# EAGLE design bmscableNucleo (EAGLE 4.13)
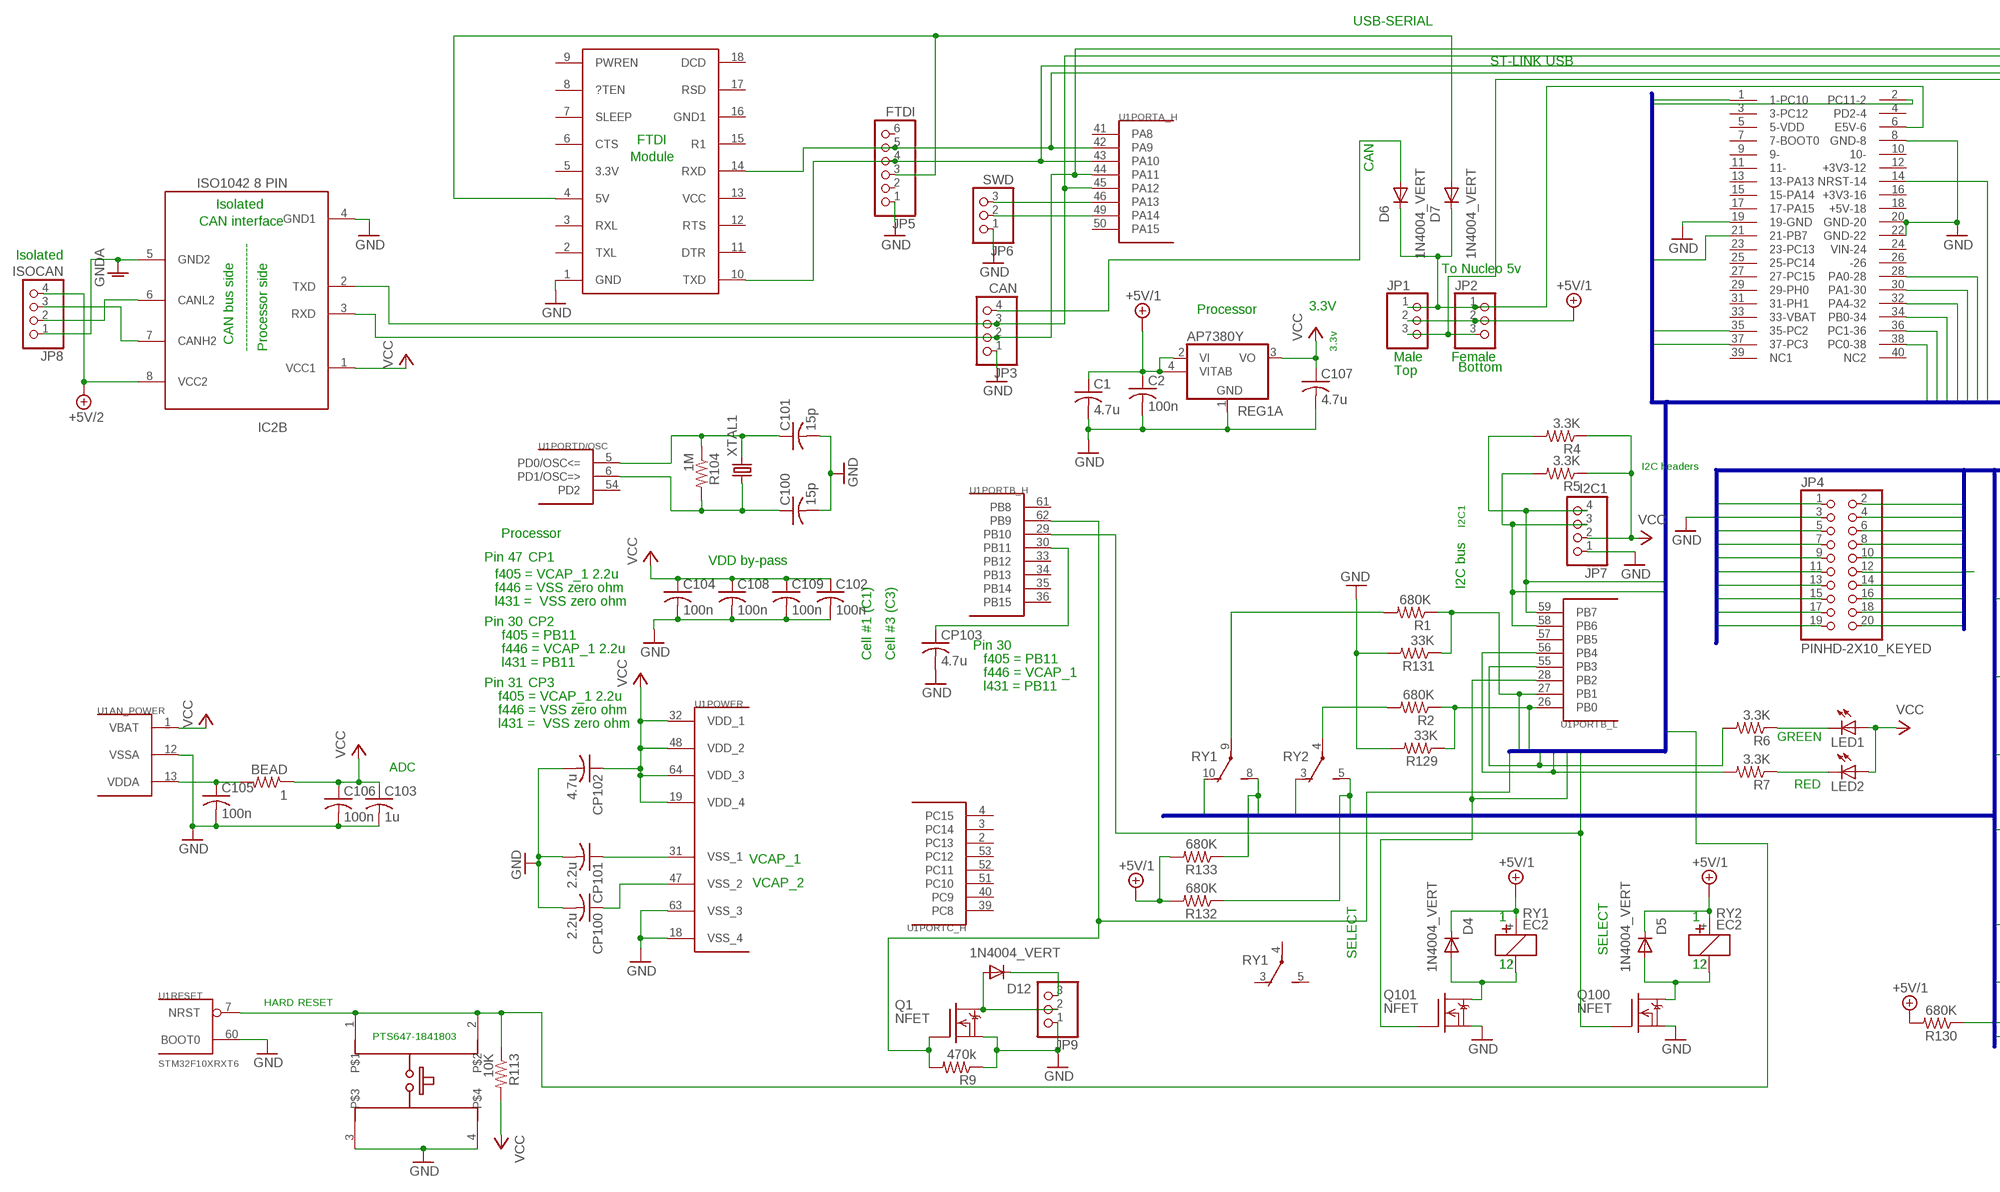
[diagram p0: schematic, sheet 1, part 1 of 2]
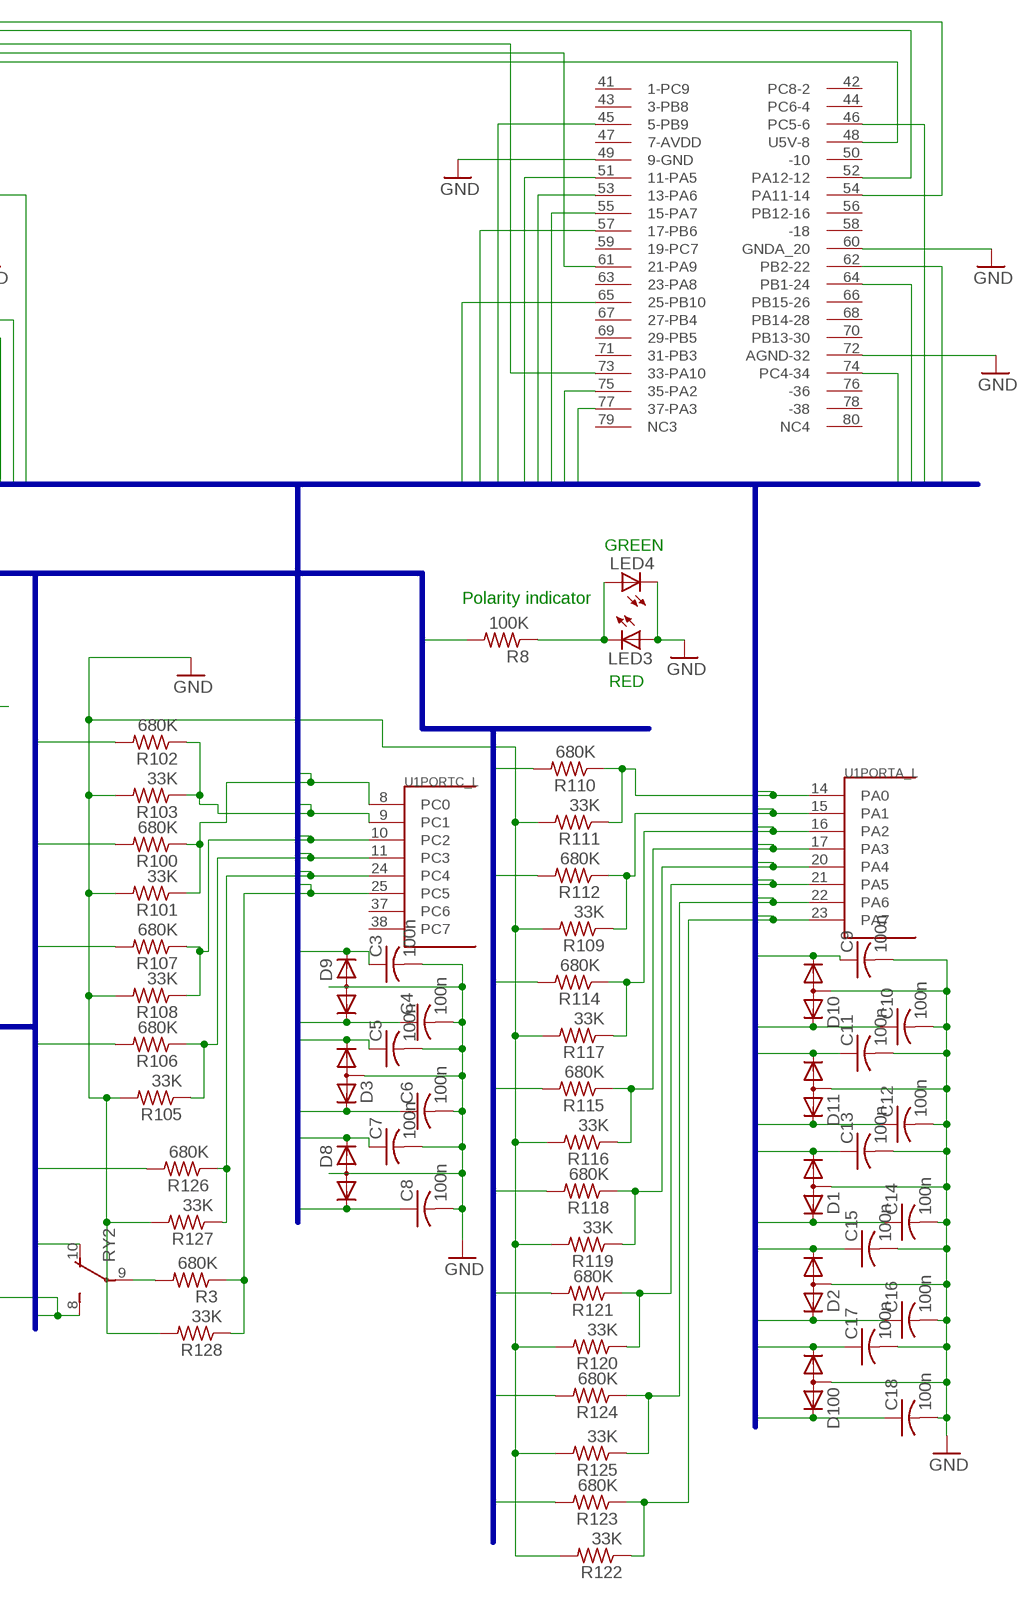
[diagram p1: schematic, sheet 1, part 2 of 2]

## Parts
BEAD  1  R-US_R0603  [R0603]
C1  4.7u  C-USC0603  [C0603]
C2  100n  C-USC0603  [C0603]
C3  100n  C-USC0603  [C0603]
C4  100n  C-USC0603  [C0603]
C5  100n  C-USC0603  [C0603]
C6  100n  C-USC0603  [C0603]
C7  100n  C-USC0603  [C0603]
C8  100n  C-USC0603  [C0603]
C9  100n  C-USC0603  [C0603]
C10  100n  C-USC0603  [C0603]
C11  100n  C-USC0603  [C0603]
C12  100n  C-USC0603  [C0603]
C13  100n  C-USC0603  [C0603]
C14  100n  C-USC0603  [C0603]
C15  100n  C-USC0603  [C0603]
C16  100n  C-USC0603  [C0603]
C17  100n  C-USC0603  [C0603]
C18  100n  C-USC0603  [C0603]
C100  15p  C-USC0603  [C0603]
C101  15p  C-USC0603  [C0603]
C102  100n  C-USC0603  [C0603]
C103  1u  C-USC0603  [C0603]
C104  100n  C-USC0603  [C0603]
C105  100n  C-USC0603  [C0603]
C106  100n  C-USC0603  [C0603]
C107  4.7u  C-USC0805  [C0805]
C108  100n  C-USC0603  [C0603]
C109  100n  C-USC0603  [C0603]
CP100  2.2u  C-USC0603  [C0603]
CP101  2.2u  C-USC0603  [C0603]
CP102  4.7u  C-USC0603  [C0603]
CP103  4.7u  C-USC0603  [C0603]
D1  DIODE-2CA|ACSOT23  [SOT23]
D2  DIODE-2CA|ACSOT23  [SOT23]
D3  DIODE-2CA|ACSOT23  [SOT23]
D4  1N4004_VERT  [DO41-10_VERT]
D5  1N4004_VERT  [DO41-10_VERT]
D6  1N4004_VERT  [DO41-10_VERT]
D7  1N4004_VERT  [DO41-10_VERT]
D8  DIODE-2CA|ACSOT23  [SOT23]
D9  DIODE-2CA|ACSOT23  [SOT23]
D10  DIODE-2CA|ACSOT23  [SOT23]
D11  DIODE-2CA|ACSOT23  [SOT23]
D12  1N4004_VERT  [DO41-10_VERT]
D100  DIODE-2CA|ACSOT23  [SOT23]
IC2B  ISO1042 8 PIN  ISO1042  [SO-08]
JP1  PINHD-1X3  [1X03]
JP2  PINHD-1X3  [1X03]
JP3  CAN  PINHD-1X4  [1X04]
JP4  PINHD-2X10_KEYED  [2X10_KEYED]
JP5  FTDI  PINHD-1X6  [1X06]
JP6  SWD  PINHD-1X3  [1X03]
JP7  I2C1  PINHD-1X4  [1X04]
JP8  ISOCAN  PINHD-1X4  [1X04]
JP9  PINHD-1X3  [1X03]
LED1  LEDCHIP-LED0603  [CHIP-LED0603]
LED2  LEDCHIP-LED0603  [CHIP-LED0603]
LED3  LEDCHIP-LED0603  [CHIP-LED0603]
LED4  LEDCHIP-LED0603  [CHIP-LED0603]
NUCLEO-HEADER  NUCLEO446R-20  [NUCLEO-64-20]
Q1  NFET  DMN3404L  [SOT-23]
Q100  NFET  DMN3404L  [SOT-23]
Q101  NFET  DMN3404L  [SOT-23]
R1  680K  R-US_R0603  [R0603]
R2  680K  R-US_R0603  [R0603]
R3  680K  R-US_R0603  [R0603]
R4  3.3K  R-US_R0603  [R0603]
R5  3.3K  R-US_R0603  [R0603]
R6  3.3K  R-US_R0603  [R0603]
R7  3.3K  R-US_R0603  [R0603]
R8  100K  R-US_R0603  [R0603]
R9  470k  R-US_R0603  [R0603]
R100  680K  R-US_R0603  [R0603]
R101  33K  R-US_R0603  [R0603]
R102  680K  R-US_R0603  [R0603]
R103  33K  R-US_R0603  [R0603]
R104  1M  R-US_R0603  [R0603]
R105  33K  R-US_R0603  [R0603]
R106  680K  R-US_R0603  [R0603]
R107  680K  R-US_R0603  [R0603]
R108  33K  R-US_R0603  [R0603]
R109  33K  R-US_R0603  [R0603]
R110  680K  R-US_R0603  [R0603]
R111  33K  R-US_R0603  [R0603]
R112  680K  R-US_R0603  [R0603]
R113  10K  R-US_R0603  [R0603]
R114  680K  R-US_R0603  [R0603]
R115  680K  R-US_R0603  [R0603]
R116  33K  R-US_R0603  [R0603]
R117  33K  R-US_R0603  [R0603]
R118  680K  R-US_R0603  [R0603]
R119  33K  R-US_R0603  [R0603]
R120  33K  R-US_R0603  [R0603]
R121  680K  R-US_R0603  [R0603]
R122  33K  R-US_R0603  [R0603]
R123  680K  R-US_R0603  [R0603]
R124  680K  R-US_R0603  [R0603]
R125  33K  R-US_R0603  [R0603]
R126  680K  R-US_R0603  [R0603]
R127  33K  R-US_R0603  [R0603]
R128  33K  R-US_R0603  [R0603]
R129  33K  R-US_R0603  [R0603]
R130  680K  R-US_R0603  [R0603]
R131  33K  R-US_R0603  [R0603]
R132  680K  R-US_R0603  [R0603]
R133  680K  R-US_R0603  [R0603]
REG1A  AP7380Y  [SOT89]
RESET  RESET  E-SWITCH2  [E-SWITCH2]
RY1  EC2  [EC2]
RY2  EC2  [EC2]
U1  STM32F10XRXT6  [TQFP64]
USB-SERIAL  USB-UART  [USB-UART]
XTAL1  CRYTALHC49S  [HC49/S]

## Nets
+5V/1: C1.1 C2.1 D4.C D5.C JP1.2 JP2.2 R130.2 R132.2 R133.2 REG1A.2(VI) REG1A.4(VITAB) RY1.+ RY2.+
+5V/2: IC2B.8(VCC2) JP8.4
C0: JP4.4 R130.1 RY2.8(S)
C1: JP4.13 R114.2
C2: JP4.5 RY1.10(O)
C3: JP4.14 R115.2
C4: JP4.6 RY2.3(O)
C5: JP4.15 R110.2
C6: JP4.7 R126.2
C7: JP4.16 R112.2
C8: JP4.8 RY2.10(O)
C9: JP4.17 R107.2
C10: JP4.9 R124.2
C11: JP4.18 R106.2
C12: JP4.10 R123.2
C13: JP4.19 R100.2
C14: JP4.11 R118.2
C15: JP4.20 R102.2
C16: JP4.12 R8.2 R121.2
CAN1-RX: IC2B.3(RXD) JP3.2 NUCLEO-HEADER.54(PA11-14) U1.44(PORTA_H:PA11)
CAN1-TX: IC2B.2(TXD) JP3.3 NUCLEO-HEADER.52(PA12-12) U1.45(PORTA_H:PA12)
CAN-EXT-5V: D6.A JP3.4
CANH2: IC2B.7(CANH2) JP8.3
CANL2: IC2B.6(CANL2) JP8.2
E5V->NUCLEO: D6.C D7.C JP1.1 JP2.1 NUCLEO-HEADER.6(E5V-6)
FET-DIODE: D12.C JP9.3
FET-DRAIN: D12.A JP9.2 Q1.3(D)
FROM-U5V: JP1.3 JP2.3 NUCLEO-HEADER.48(U5V-8)
GND: C1.2 C2.2 C3.2 C4.2 C5.2 C6.2 C7.2 C8.2 C9.2 C10.2 C11.2 C12.2 C13.2 C14.2 C15.2 C16.2 C17.2 C18.2 C100.2 C101.2 C102.2 C103.2 C104.2 C105.2 C106.2 C107.2 C108.2 C109.2 CP100.2 CP101.2 CP102.2 CP103.2 D1.3(A) D2.3(A) D3.3(A) D8.3(A) D9.3(A) D10.3(A) D11.3(A) D100.3(A) IC2B.4(GND1) JP3.1 JP4.3 JP5.1 JP6.1 JP7.1 JP9.1 LED3.A LED4.C NUCLEO-HEADER.8(GND-8) NUCLEO-HEADER.19(19-GND) NUCLEO-HEADER.20(GND-20) NUCLEO-HEADER.22(GND-22) NUCLEO-HEADER.49(9-GND) NUCLEO-HEADER.60(GNDA_20) NUCLEO-HEADER.72(AGND-32) Q1.2(S) Q100.2(S) Q101.2(S) R9.1 R101.2 R103.2 R105.2 R108.2 R109.2 R111.2 R116.2 R117.2 R119.2 R120.2 R122.2 R125.2 R127.2 R128.2 R129.2 R131.2 REG1A.1(GND) RESET.3 RESET.4 U1.12(AN_POWER:VSSA) U1.18(POWER:VSS_4) U1.60(RESET:BOOT0) U1.63(POWER:VSS_3) USB-SERIAL.1(GND)
GNDA: IC2B.5(GND2) JP8.1
GRN-RED-POLARITY-100K: LED3.C LED4.A R8.1
LED-EXT-GRN-CATHODE: LED1.C R6.1
LED-EXT-RED-CATHODE: LED2.C R7.1
PA0: C12.1 D11.2(K2) NUCLEO-HEADER.28(PA0-28) R110.1 R111.1 U1.14(PORTA_L:PA0)
PA1: C11.1 D11.1(K1) NUCLEO-HEADER.30(PA1-30) R109.1 R112.1 U1.15(PORTA_L:PA1)
PA2: C17.1 D100.1(K1) NUCLEO-HEADER.75(35-PA2) R114.1 R117.1 U1.16(PORTA_L:PA2)
PA3: C18.1 D100.2(K2) NUCLEO-HEADER.77(37-PA3) R115.1 R116.1 U1.17(PORTA_L:PA3)
PA4: C10.1 D10.2(K2) NUCLEO-HEADER.32(PA4-32) R118.1 R119.1 U1.20(PORTA_L:PA4)
PA5: C5.1 D3.1(K1) NUCLEO-HEADER.51(11-PA5) R120.1 R121.1 U1.21(PORTA_L:PA5)
PA6: C14.1 D1.2(K2) NUCLEO-HEADER.53(13-PA6) R124.1 R125.1 U1.22(PORTA_L:PA6)
PA7: C13.1 D1.1(K1) NUCLEO-HEADER.55(15-PA7) R122.1 R123.1 U1.23(PORTA_L:PA7)
PA9-USART1-TX: JP5.5 NUCLEO-HEADER.61(21-PA9) U1.42(PORTA_H:PA9) USB-SERIAL.14(RXD)
PA10-USART1-RX: JP5.4 NUCLEO-HEADER.73(33-PA10) U1.43(PORTA_H:PA10) USB-SERIAL.10(TXD)
PA13-SWDIO: JP6.3 U1.46(PORTA_H:PA13)
PA14-SWCLK: JP6.2 U1.49(PORTA_H:PA14)
PB0: C9.1 D10.1(K1) NUCLEO-HEADER.34(PB0-34) R2.1 R129.1 U1.26(PORTB_L:PB0)
PB0-680K-RY2: R2.2 RY2.4(P)
PB1: C16.1 D2.2(K2) NUCLEO-HEADER.64(PB1-24) R1.1 R131.1 U1.27(PORTB_L:PB1)
PB1-680K-RY1: R1.2 RY1.9(P)
PB2: NUCLEO-HEADER.62(PB2-22) Q101.1(G) U1.28(PORTB_L:PB2)
PB6: JP7.3 NUCLEO-HEADER.57(17-PB6) R5.2 U1.58(PORTB_L:PB6)
PB7: JP7.4 NUCLEO-HEADER.21(21-PB7) R4.2 U1.59(PORTB_L:PB7)
PB9: NUCLEO-HEADER.45(5-PB9) Q1.1(G) R9.2 U1.62(PORTB_H:PB9)
PB10: NUCLEO-HEADER.65(25-PB10) Q100.1(G) U1.29(PORTB_H:PB10)
PB11-I2C2-SDA|VCAP1: CP103.1 U1.30(PORTB_H:PB11)
PC0: C7.1 D8.2(K2) NUCLEO-HEADER.38(PC0-38) R100.1 R101.1 U1.8(PORTC_L:PC0)
PC1: C3.1 D9.2(K2) NUCLEO-HEADER.36(PC1-36) R102.1 R103.1 U1.9(PORTC_L:PC1)
PC2: C4.1 D9.1(K1) NUCLEO-HEADER.35(35-PC2) R107.1 R108.1 U1.10(PORTC_L:PC2)
PC3: C8.1 D8.1(K1) NUCLEO-HEADER.37(37-PC3) R105.1 R106.1 U1.11(PORTC_L:PC3)
PC4: C15.1 D2.1(K1) NUCLEO-HEADER.74(PC4-34) R126.1 R127.1 U1.24(PORTC_L:PC4)
PC5: C6.1 D3.2(K2) NUCLEO-HEADER.46(PC5-6) R3.1 R128.1 U1.25(PORTC_L:PC5)
PC5-680K-RY2: R3.2 RY2.9(P)
PC10: NUCLEO-HEADER.1(1-PC10) R7.2 U1.56(PORTB_L:PB4)
PC11: NUCLEO-HEADER.2(PC11-2) R6.2 U1.55(PORTB_L:PB3)
PD0_OSC_IN_XTAL: C101.1 R104.1 U1.5(PORTD/OSC:PD0/OSC<=) XTAL1.2
PD1_OSC_OUT: C100.1 R104.2 U1.6(PORTD/OSC:PD1/OSC=>) XTAL1.1
PGND-SRN: JP4.1 R132.1 RY2.5(S)
Q12-DRAIN-RELAY: D4.A Q101.3(D) RY1.-
Q12-DRAIN-RELAY1: D5.A Q100.3(D) RY2.-
RESET: NUCLEO-HEADER.14(NRST-14) R113.1 RESET.1 RESET.2 U1.7(RESET:NRST)
SRP: JP4.2 R133.1 RY1.8(S)
USB-SERIAL-5V: D7.A JP5.3 USB-SERIAL.4(5V)
VCC: BEAD.1 C102.1 C103.1 C104.1 C106.1 C107.1 C108.1 C109.1 CP102.1 IC2B.1(VCC1) JP7.2 LED1.A LED2.A R4.1 R5.1 R113.2 REG1A.3(VO) U1.1(AN_POWER:VBAT) U1.19(POWER:VDD_4) U1.32(POWER:VDD_1) U1.48(POWER:VDD_2) U1.64(POWER:VDD_3)
VDDA1: BEAD.2 C105.1 U1.13(AN_POWER:VDDA)
VSS_1-VCAP_1: CP101.1 U1.31(POWER:VSS_1)
VSS_3: CP100.1 U1.47(POWER:VSS_2)
Unconnected: JP5.2 JP5.6 NUCLEO-HEADER.3(3-PC12) NUCLEO-HEADER.4(PD2-4) NUCLEO-HEADER.5(5-VDD) NUCLEO-HEADER.7(7-BOOT0) NUCLEO-HEADER.9(9-) NUCLEO-HEADER.10(10-) NUCLEO-HEADER.11(11-) NUCLEO-HEADER.12(+3V3-12) NUCLEO-HEADER.13(13-PA13) NUCLEO-HEADER.15(15-PA14) NUCLEO-HEADER.16(+3V3-16) NUCLEO-HEADER.17(17-PA15) NUCLEO-HEADER.18(+5V-18) NUCLEO-HEADER.23(23-PC13) NUCLEO-HEADER.24(VIN-24) NUCLEO-HEADER.25(25-PC14) NUCLEO-HEADER.26(-26) NUCLEO-HEADER.27(27-PC15) NUCLEO-HEADER.29(29-PH0) NUCLEO-HEADER.31(31-PH1) NUCLEO-HEADER.33(33-VBAT) NUCLEO-HEADER.39(NC1) NUCLEO-HEADER.40(NC2) NUCLEO-HEADER.41(1-PC9) NUCLEO-HEADER.42(PC8-2) NUCLEO-HEADER.43(3-PB8) NUCLEO-HEADER.44(PC6-4) NUCLEO-HEADER.47(7-AVDD) NUCLEO-HEADER.50(-10) NUCLEO-HEADER.56(PB12-16) NUCLEO-HEADER.58(-18) NUCLEO-HEADER.59(19-PC7) NUCLEO-HEADER.63(23-PA8) NUCLEO-HEADER.66(PB15-26) NUCLEO-HEADER.67(27-PB4) NUCLEO-HEADER.68(PB14-28) NUCLEO-HEADER.69(29-PB5) NUCLEO-HEADER.70(PB13-30) NUCLEO-HEADER.71(31-PB3) NUCLEO-HEADER.76(-36) NUCLEO-HEADER.78(-38) NUCLEO-HEADER.79(NC3) NUCLEO-HEADER.80(NC4) RY1.3(O) RY1.4(P) RY1.5(S) U1.2(PORTC_H:PC13) U1.3(PORTC_H:PC14) U1.4(PORTC_H:PC15) U1.33(PORTB_H:PB12) U1.34(PORTB_H:PB13) U1.35(PORTB_H:PB14) U1.36(PORTB_H:PB15) U1.37(PORTC_L:PC6) U1.38(PORTC_L:PC7) U1.39(PORTC_H:PC8) U1.40(PORTC_H:PC9) U1.41(PORTA_H:PA8) U1.50(PORTA_H:PA15) U1.51(PORTC_H:PC10) U1.52(PORTC_H:PC11) U1.53(PORTC_H:PC12) U1.54(PORTD/OSC:PD2) U1.57(PORTB_L:PB5) U1.61(PORTB_H:PB8) USB-SERIAL.2(TXL) USB-SERIAL.3(RXL) USB-SERIAL.5(3.3V) USB-SERIAL.6(CTS) USB-SERIAL.7(SLEEP) USB-SERIAL.8(?TEN) USB-SERIAL.9(PWREN) USB-SERIAL.11(DTR) USB-SERIAL.12(RTS) USB-SERIAL.13(VCC) USB-SERIAL.15(R1) USB-SERIAL.16(GND1) USB-SERIAL.17(RSD) USB-SERIAL.18(DCD)

## Buses
HDR$:PGND-SRN,SRP,VSS,C[0..16]
NUC$:PB[0..15],PA[0..15],PC[0..15],RESET

## Notes on the sheet
- USB-SERIAL
- ST-LINK USB
- FTDI
- Module
- CAN
- Isolated
- CAN interface
- Isolated
- To Nucleo 5v
- Processor | 3.3V
- 3.3v
- CAN bus side
- ------------------------ | Processor side
- Male | Female
- Top | Bottom
- GREEN
- I2C headers
- Polarity indicator
- I2C1
- Processor
- RED
- Pin 47 | CP1 | VDD by-pass
- f405 = VCAP_1 2.2u
- f446 = VSS zero ohm | I2C bus
- l431 =  VSS zero ohm
- Pin 30 | CP2
- f405 = PB11
- f446 = VCAP_1 2.2u | Pin 30
- Cell #1 (C1) | Cell #3 (C3) | f405 = PB11
- l431 = PB11
- f446 = VCAP_1
- Pin 31 | CP3 | l431 = PB11
- f405 = VCAP_1 2.2u
- f446 = VSS zero ohm
- l431 =  VSS zero ohm
- GREEN
- ADC
- RED
- VCAP_1
- VCAP_2
- 1 | 1
- SELECT | SELECT
- 12 | 12
- HARD | RESET
- PTS647-1841803

## Library data of the parts
BEAD R1-R9 R100-R133 = rcl:R-US_: RESISTOR, American symbol
C1-C18 C100-C109 CP100-CP103 = rcl:C-US: CAPACITOR, American symbol
D1-D3 D8-D11 D100 = diode-1:DIODE-2CA|AC: Dual DIODE Cathode-Anode|Anode-Cathode
D4-D7 D12 = diode:1N4004_VERT
IC2B = texas:ISO1042
JP1 JP2 JP6 JP9 = pinhead:PINHD-1X3: PIN HEADER
JP3 JP7 JP8 = pinhead:PINHD-1X4: PIN HEADER
JP4 = pinhead:PINHD-2X10_KEYED
JP5 = pinhead:PINHD-1X6: PIN HEADER
LED1-LED4 = led:LED: LED OSRAM: - CHIPLED LG R971, LG N971, LY N971, LG Q971, LY Q971, LO R971, LY R971 LH N974, LH R974 LS Q976, LO Q976, LY Q976 LO Q996 - Hyper CHIPLED LW Q18S LB Q993, LB Q99A, LB R99A - SideLED LS A670, LO A670, LY A670, LG A670, LP A670 LB A673, LV A673, LT A673, LW A673 LH A674 LY A675 LS A676, LA A676, LO A676, LY A676, LW A676 LS A679, LY A679, LG A679 - Hyper Micro SIDELED® LS Y876, LA Y876, LO Y876, LY Y876 LT Y87S - SmartLED LW L88C, LW L88S LB L89C, LB L89S, LG L890 LS L89K, LO L89K, LY L89K LS L896, LA L896, LO L896, LY L896 - TOPLED LS T670, LO T670, LY T670, LG T670, LP T670 LSG T670, LSP T670, LSY T670, LOP T670, LYG T670 LG T671, LOG T671, LSG T671 LB T673, LV T673, LT T673, LW T673 LH T674 LS T676, LA T676, LO T676, LY T676, LB T676, LH T676, LSB T676, LW T676 LB T67C, LV T67C, LT T67C, LS T67K, LO T67K, LY T67K, LW E67C LS E67B, LA E67B, LO E67B, LY E67B, LB E67C, LV E67C, LT E67C LW T67C LS T679, LY T679, LG T679 LS T770, LO T770, LY T770, LG T770, LP T770 LB T773, LV T773, LT T773, LW T773 LH T774 LS E675, LA E675, LY E675, LS T675 LS T776, LA T776, LO T776, LY T776, LB T776 LHGB T686 LT T68C, LB T68C - Hyper Mini TOPLED® LB M676 - Mini TOPLED Santana® LG M470 LS M47K, LO M47K, LY M47K Source: http://www.osram.convergy.de/
NUCLEO-HEADER = pinhead:NUCLEO446R-20
Q1 Q100 Q101 = transistor-fet:DMN3404L
REG1A = linear:AP7380Y
RESET = switch-misc:E-SWITCH2
RY1 RY2 = relay:EC2
U1 = stm32:STM32F10XRXT6: STM32F101/103 64pin LQFP
USB-SERIAL = pinhead:USB-UART
XTAL1 = crystal:CRYTAL: CRYSTAL

## Board
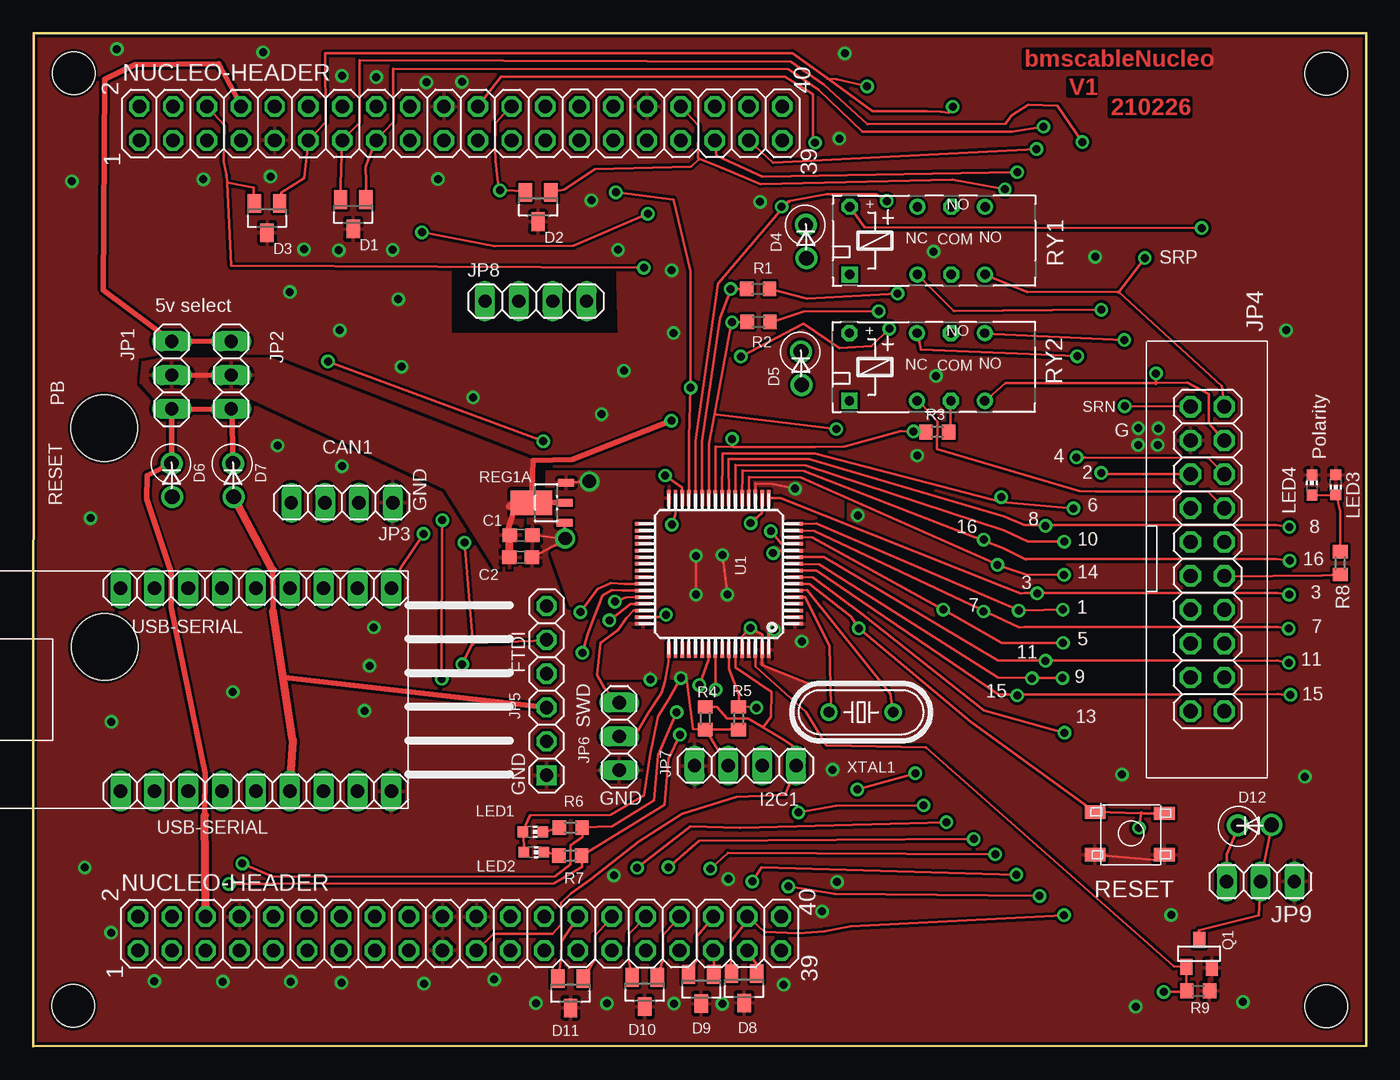
[diagram p2: board, top side]
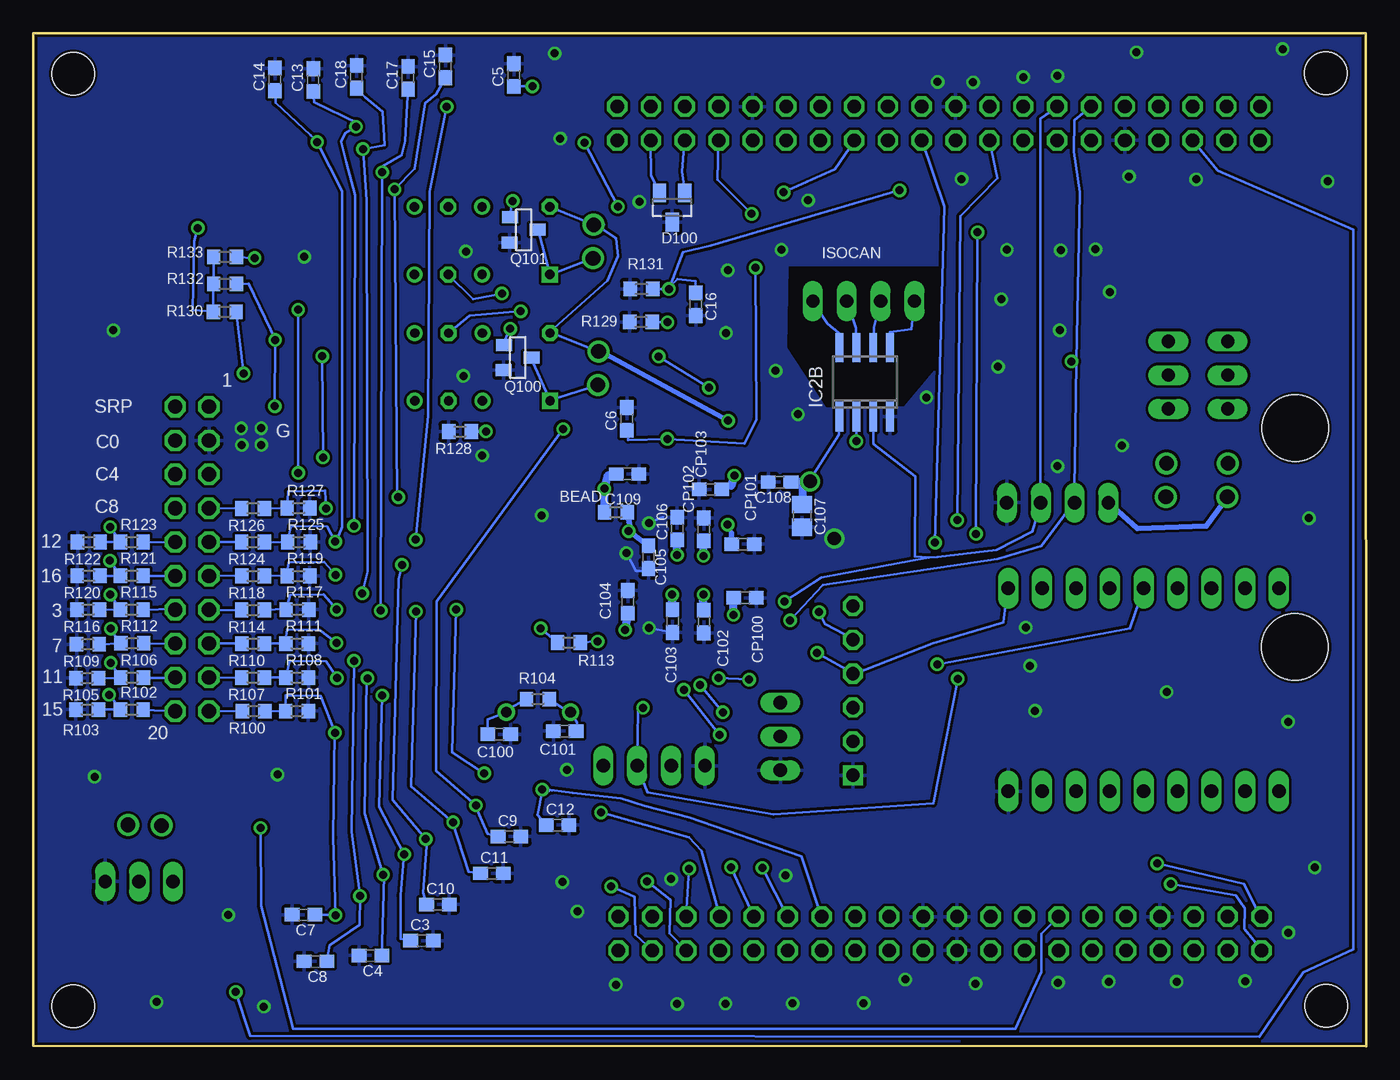
[diagram p3: board, bottom side, seen from below]

Size 100.02 x 76.03 mm. Coordinates in mm from the lower left corner, seen from the top.
Outline: 0,0 0.02,76.03 100.02,76.03 100.02,0.03 0,0
Copper layers (1*16): Top 0.035mm / dielectric 1.5mm / Bottom 0.035mm
Design rules "default": minimum track width 8mil, minimum drill 0.6mm, track to track 8mil, track to pad 8mil, pad to pad 8mil, via to via 8mil, smd to smd 0mil, copper to edge 8mil, drill to drill 8mil, minimum pad ring 10mil, minimum via ring 8mil, stop-mask expansion 4mil, vias tented up to drill 0mil, thermal gap 10mil
Holes 5 mm at 5.31,46.41 5.34,29.98
Holes 3.2 mm at 3.01,3.03 3.03,73.02 97.03,73 97.01,3.02

### Footprints (pad centres in the part's own frame; a part is rotated, then mirrored left to right if it is on the bottom)
R0603 = smd 1 x 1.1: 1 -0.85,0; 2 0.85,0
C0603 = smd 1.1 x 1: 1 -0.85,0; 2 0.85,0
C0805 = smd 1.3 x 1.5: 1 -0.85,0; 2 0.85,0
SOT23 = smd 1 x 1.4: 1 -0.95,-1.1; 2 0.95,-1.1; 3 0,1.1
DO41-10_VERT = drill 1.1 round: A 2.58,0.05; C 0.07,0
SO-08 = smd 0.6 x 2.2: 1 -1.905,-2.6; 2 -0.635,-2.6; 3 0.635,-2.6; 4 1.905,-2.6; 5 1.905,2.6; 6 0.635,2.6; 7 -0.635,2.6; 8 -1.905,2.6
1X03 = drill 1 long: 1 -2.54,0; 2 0,0; 3 2.54,0
1X04 = drill 1 long: 1 -3.81,0; 2 -1.27,0; 3 1.27,0; 4 3.81,0
2X10_KEYED = drill 1.067 octagon: 1 -11.46,-1.27; 2 -11.46,1.27; 3 -8.92,-1.27; 4 -8.92,1.27; 5 -6.38,-1.27; 6 -6.38,1.27; 7 -3.84,-1.27; 8 -3.84,1.27; 9 -1.3,-1.27; 10 -1.3,1.27; 11 1.24,-1.27; 12 1.24,1.27; 13 3.78,-1.27; 14 3.78,1.27; 15 6.32,-1.27; 16 6.32,1.27; 17 8.86,-1.27; 18 8.86,1.27; 19 11.4,-1.27; 20 11.4,1.27
1X06 = drill 1 square: 1 -6.35,0 | drill 1 octagon: 2 -3.81,0; 3 -1.27,0; 4 1.27,0; 5 3.81,0; 6 6.35,0
CHIP-LED0603 = smd 0.8 x 0.8: A 0,-0.75; C 0,0.75
NUCLEO-64-20 = drill 1.016 octagon: 1 -31.68,24.23; 2 -29.14,24.23; 3 -31.68,21.69; 4 -29.14,21.69; 5 -31.68,19.15; 6 -29.14,19.15; 7 -31.68,16.61; 8 -29.14,16.61; 9 -31.68,14.07; 10 -29.14,14.07; 11 -31.68,11.53; 12 -29.14,11.53; 13 -31.68,8.99; 14 -29.14,8.99; 15 -31.68,6.45; 16 -29.14,6.45; 17 -31.68,3.91; 18 -29.14,3.91; 19 -31.68,1.37; 20 -29.14,1.37; 21 -31.68,-1.17; 22 -29.14,-1.17; 23 -31.68,-3.71; 24 -29.14,-3.71; 25 -31.68,-6.25; 26 -29.14,-6.25; 27 -31.68,-8.79; 28 -29.14,-8.79; 29 -31.68,-11.33; 30 -29.14,-11.33; 31 -31.68,-13.87; 32 -29.14,-13.87; 33 -31.68,-16.41; 34 -29.14,-16.41; 35 -31.68,-18.95; 36 -29.14,-18.95; 37 -31.68,-21.49; 38 -29.14,-21.49; 39 -31.68,-24.03; 40 -29.14,-24.03; 41 29.12,24.13; 42 31.66,24.13; 43 29.12,21.59; 44 31.66,21.59; 45 29.12,19.05; 46 31.66,19.05; 47 29.12,16.51; 48 31.66,16.51; 49 29.12,13.97; 50 31.66,13.97; 51 29.12,11.43; 52 31.66,11.43; 53 29.12,8.89; 54 31.66,8.89; 55 29.12,6.35; 56 31.66,6.35; 57 29.12,3.81; 58 31.66,3.81; 59 29.12,1.27; 60 31.66,1.27; 61 29.12,-1.27; 62 31.66,-1.27; 63 29.12,-3.81; 64 31.66,-3.81; 65 29.12,-6.35; 66 31.66,-6.35; 67 29.12,-8.89; 68 31.66,-8.89; 69 29.12,-11.43; 70 31.66,-11.43; 71 29.12,-13.97; 72 31.66,-13.97; 73 29.12,-16.51; 74 31.66,-16.51; 75 29.12,-19.05; 76 31.66,-19.05; 77 29.12,-21.59; 78 31.66,-21.59; 79 29.12,-24.13; 80 31.66,-24.13
SOT-23 = smd 0.9 x 1.2: 1 -1,-1.006; 2 0.9,-1.056; 3 -0.05,1.056
SOT89 = smd 0.55 x 1.2: 1 -1.5,-1.4; 2 0,-1.4; 3 1.5,-1.5 | smd 1.85 x 3.1: 4 0,1.1
E-SWITCH2 = smd 1.55 x 1: 1 -2.7,1.6; 2 2.5,1.5; 3 2.5,-1.6; 4 -2.7,-1.6
EC2 = drill 0.7 round: 3 -1.27,2.54; 5 3.81,2.54; 8 3.81,-2.54; 10 -1.27,-2.54 | drill 0.7 octagon: 4 1.27,2.54; 9 1.27,-2.54; + -6.35,2.54 | drill 0.7 square: - -6.35,-2.54
TQFP64 = smd 1.2 x 0.26: 1 -5.7,3.75; 2 -5.7,3.25; 3 -5.7,2.75; 4 -5.7,2.25; 5 -5.7,1.75; 6 -5.7,1.25; 7 -5.7,0.75; 8 -5.7,0.25; 9 -5.7,-0.25; 10 -5.7,-0.75; 11 -5.7,-1.25; 12 -5.7,-1.75; 13 -5.7,-2.25; 14 -5.7,-2.75; 15 -5.7,-3.25; 16 -5.7,-3.75; 33 5.7,-3.75; 34 5.7,-3.25; 35 5.7,-2.75; 36 5.7,-2.25; 37 5.7,-1.75; 38 5.7,-1.25; 39 5.7,-0.75; 40 5.7,-0.25; 41 5.7,0.25; 42 5.7,0.75; 43 5.7,1.25; 44 5.7,1.75; 45 5.7,2.25; 46 5.7,2.75; 47 5.7,3.25; 48 5.7,3.75 | smd 0.26 x 1.2: 17 -3.75,-5.7; 18 -3.25,-5.7; 19 -2.75,-5.7; 20 -2.25,-5.7; 21 -1.75,-5.7; 22 -1.25,-5.7; 23 -0.75,-5.7; 24 -0.25,-5.7; 25 0.25,-5.7; 26 0.75,-5.7; 27 1.25,-5.7; 28 1.75,-5.7; 29 2.25,-5.7; 30 2.75,-5.7; 31 3.25,-5.7; 32 3.75,-5.7; 49 3.75,5.7; 50 3.25,5.7; 51 2.75,5.7; 52 2.25,5.7; 53 1.75,5.7; 54 1.25,5.7; 55 0.75,5.7; 56 0.25,5.7; 57 -0.25,5.7; 58 -0.75,5.7; 59 -1.25,5.7; 60 -1.75,5.7; 61 -2.25,5.7; 62 -2.75,5.7; 63 -3.25,5.7; 64 -3.75,5.7
USB-UART = drill 1.016 long: 1 -7.62,-8.89; 2 -7.62,-6.35; 3 -7.62,-3.81; 4 -7.62,-1.27; 5 -7.62,1.27; 6 -7.62,3.81; 7 -7.62,6.35; 8 -7.62,8.89; 9 -7.62,11.43; 10 7.62,-8.89; 11 7.62,-6.35; 12 7.62,-3.81; 13 7.62,-1.27; 14 7.62,1.27; 15 7.62,3.81; 16 7.62,6.35; 17 7.62,8.89; 18 7.62,11.43
HC49/S = drill 0.8 round: 1 -2.413,0; 2 2.413,0

### Placement (x,y rotation side)
BEAD  56.31,40.08 0 bottom
C1  36.6,38.36 0 top
C2  36.57,36.7 0 top
C3  70.86,7.94 0 bottom
C4  74.72,6.82 180 bottom
C5  63.96,72.9 90 bottom
C6  55.48,47.09 90 bottom
C7  79.75,9.88 180 bottom
C8  78.85,6.38 180 bottom
C9  64.29,15.75 0 bottom
C10  69.66,10.65 0 bottom
C11  65.61,12.98 0 bottom
C12  60.68,16.61 0 bottom
C13  79.01,72.52 90 bottom
C14  81.89,72.57 90 bottom
C15  69.1,73.55 90 bottom
C16  50.31,55.69 270 bottom
C17  71.9,72.69 90 bottom
C18  75.76,72.76 90 bottom
C100  65.06,23.43 0 bottom
C101  60.14,23.66 180 bottom
C102  49.7,31.88 270 bottom
C103  52.05,31.91 270 bottom
C104  55.4,33.37 90 bottom
C105  53.86,36.71 270 bottom
C106  51.7,38.86 90 bottom
C107  42.33,39.82 270 bottom
C108  44.01,42.35 180 bottom
C109  55.43,42.96 0 bottom
CP100  46.61,33.67 0 bottom
CP101  46.77,37.69 0 bottom
CP102  49.7,38.8 90 bottom
CP103  49.2,41.8 180 bottom
D1  24.01,62.45 180 top
D2  37.88,63 180 top
D3  17.54,62.16 180 top
D4  57.97,61.73 270 top
D5  57.6,52.22 270 top
D6  10.37,43.82 270 top
D7  14.98,43.82 270 top
D8  53.34,4.36 180 top
D9  50.12,4.31 180 top
D10  45.88,4.08 180 top
D11  40.31,3.99 180 top
D12  90.33,16.57 0 top
D100  52.08,62.96 180 bottom
IC2B  37.63,49.85 0 bottom
JP1  10.39,50.38 90 top
JP2  14.85,50.38 90 top
JP3  23.16,40.81 180 top
JP4  88.11,36.55 270 top
JP5  38.52,26.7 90 top
JP6  43.96,23.26 90 top
JP7  53.43,21.06 0 top
JP8  37.71,55.93 0 top
JP9  92.09,12.37 180 top
LED1  37.49,16.1 270 top
LED2  37.57,14.58 270 top
LED3  97.74,42.14 180 top
LED4  95.95,42.13 0 top
NUCLEO-HEADER  32.08,38.88 90 top
Q1  87.53,6.96 0 top
Q100  63.67,51.64 270 bottom
Q101  63.23,61.23 270 bottom
R1  54.39,56.85 0 top
R2  54.43,54.37 0 top
R3  67.83,46.11 0 top
R4  50.43,24.63 90 top
R5  52.92,24.63 90 top
R6  40.33,16.43 0 top
R7  40.29,14.31 0 top
R8  98.07,36.26 270 top
R9  87.41,4.17 180 top
R100  83.49,25.16 180 bottom
R101  80.24,25.16 0 bottom
R102  92.62,25.26 0 bottom
R103  95.97,25.27 180 bottom
R104  62.16,26.07 180 bottom
R105  95.97,27.64 180 bottom
R106  92.61,27.67 0 bottom
R107  83.54,27.68 180 bottom
R108  80.22,27.68 0 bottom
R109  95.92,30.18 180 bottom
R110  83.52,30.23 180 bottom
R111  80.22,30.23 0 bottom
R112  92.59,30.25 0 bottom
R113  59.83,30.31 0 bottom
R114  83.53,32.75 180 bottom
R115  92.62,32.77 0 bottom
R116  95.9,32.78 180 bottom
R117  80.2,32.78 0 bottom
R118  83.52,35.3 180 bottom
R119  80.12,35.3 0 bottom
R120  95.87,35.32 180 bottom
R121  92.63,35.32 0 bottom
R122  95.85,37.85 180 bottom
R123  92.62,37.85 0 bottom
R124  83.54,37.85 180 bottom
R125  80.08,37.85 0 bottom
R126  83.54,40.37 180 bottom
R127  80.12,40.4 0 bottom
R128  68,46.14 180 bottom
R129  54.42,54.37 180 bottom
R130  85.65,55.13 180 bottom
R131  54.38,56.85 180 bottom
R132  85.64,57.22 180 bottom
R133  85.64,59.24 180 bottom
REG1A  38.48,40.8 90 top
RESET  82.37,15.99 0 top
RY1  67.61,60.47 0 top
RY2  67.59,50.99 0 top
U1  51.44,35.46 180 top
USB-SERIAL  17.97,26.77 90 top
XTAL1  62.12,25.08 180 top

### Tracks (layer width: path | path; a pad name or v marks a point on that pad's centre or on a via)
+5V/1  (via drill 0.6)
  Top 0.203: 37.4,40.8 36.33,40.67 36.3,40.67 | 35.89,40.56 35.89,40.55 | C1.1 35.61,38.81 35.75,38.41 | v87.68,61.42 62.36,61.48 61.25,63.06 RY1.+
  Top 0.406: 37.4,40.8 37.52,43.95 40.41,44.03 v47.88,46.96 | JP2.2 14.83,50.33 JP1.2 | REG1A.4 37.41,40.81 REG1A.2 | 36.33,40.67 36.3,40.89 35.61,38.81
  Top 0.61: 36.33,40.67 35.89,40.56 35.74,40.53 | C2.1 35.75,38.41
  Bottom 0.203: RY1.+ 61.19,62.99 D4.C 57.2,61.67 57.4,61.36 | 61.27,53.61 RY2.+ | D5.C 61.27,53.61 | 61.27,53.61 56.94,57.47 56.16,59.29 56.31,60.67 57.4,61.36 | 57.4,61.36 57.96,61.72 | R133.2 86.47,59.14 R132.2 86.57,57.16 R130.2 88.05,55.27 87.93,60.43 v87.68,61.42
  Bottom 0.406: D5.C 57.5,52.19 v47.88,46.96
  pour Top (rank 2): 9.71,51.6 17.72,51.65 37.57,43.93 36.59,38.58 36.54,35.92 34.67,35.92 30.94,41.87 16.39,48.6 9.07,48.7 8.04,49.83 8.19,51.35
+5V/2
  Bottom 0.203: IC2B.8 39.55,53.55 40.42,54.26 41.52,55.87 JP8.4
C0  (via drill 0.6)
  Top 0.203: 89.47,45.39 JP4.4 89.34,45.47 88.2,46.77 88.2,48.95 86.61,49.8 84.22,49.8 | 84.22,49.8 72.96,49.77 71.35,48.34 RY2.8 | 84.22,49.8 84.22,49.71 v84.25,50.51
  Bottom 0.203: v84.25,50.51 R130.1
C1
  Top 1.016: JP4.13 86.87,32.76
  Bottom 0.203: R114.2 84.3,32.72 JP4.13
C2  (via drill 0.6)
  Top 0.203: v80.13,43.04 80.44,42.95 86.91,42.94 JP4.5 | v80.15,55.29 69.1,55.2 66.29,57.96 RY1.10
  Top 1.016: JP4.5
  Bottom 0.203: v80.13,43.04 v80.15,55.29
C3
  Bottom 0.203: JP4.14 89.47,32.83 R115.2
C4  (via drill 0.6)
  Top 0.203: 78.93,44.2 78.86,44.2 | 78.93,44.2 88.18,44.17 89.45,42.86 JP4.6 | v78.34,51.8 66.6,52.28 66.33,53.6 RY2.3 | 78.93,44.2 | v78.29,44.2 78.93,44.2
  Bottom 0.203: v78.34,51.8 v78.29,44.2
C5
  Top 1.016: JP4.15 86.89,30.22
  Bottom 0.203: JP4.15 86.85,30.25 R110.2
C6
  Top 1.016: JP4.7 86.87,40.37
  Bottom 0.203: R126.2 84.4,40.35 JP4.7
C7
  Top 0.203: JP4.16 89.43,30.24
  Bottom 0.203: JP4.16 89.49,30.21 R112.2
C8
  Top 0.203: 89.54,40.51 JP4.8 89.42,40.36 88.12,41.65 79.72,41.66 78.49,41.69 67.81,44.84 67.84,46.9 66.35,48.55 RY2.10
C9
  Top 1.016: JP4.17
  Bottom 0.203: JP4.17 86.85,27.67 R107.2
C10
  Top 1.016: JP4.9 86.89,37.84
  Bottom 0.203: R124.2 84.44,37.87 JP4.9
C11
  Top 0.203: JP4.18 89.33,27.76
  Bottom 0.203: JP4.18 89.43,27.67 R106.2
C12
  Bottom 0.203: JP4.10 89.28,37.81 R123.2
C13
  Top 1.016: JP4.19 86.87,25.14
  Bottom 0.203: JP4.19 86.88,25.14 R100.2
C14
  Top 1.016: JP4.11 86.87,35.3
  Bottom 0.203: R118.2 84.27,35.35 JP4.11
C15
  Bottom 0.203: 89.47,25.22 JP4.20 89.35,25.14 R102.2
C16
  Top 0.203: R8.2 96.71,35.33 89.29,35.26 JP4.12
  Bottom 0.203: JP4.12 89.4,35.29 R121.2
CAN1-RX  (via drill 0.6)
  Top 0.203: U1.44 44.48,33.69 v43.64,33.38 | JP3.2 24.38,40.84
  Bottom 0.203: v43.64,33.38 40.86,35.2 32.81,36.68 | 32.81,36.68 32.19,36.71 27.74,37.25 25.05,38.64 JP3.2 | NUCLEO-HEADER.54 24.46,69.62 24.46,67.31 24.44,42.92 JP3.2 | IC2B.3 36.97,45.2 33.84,42.77 33.85,36.78 32.81,36.68
  Bottom 0.406: JP3.2 | IC2B.3
CAN1-TX  (via drill 0.6)
  Top 0.203: U1.45 44.82,33.2 v43.23,31.97 | v22.12,51.41 v38.27,45.42
  Bottom 0.203: v43.23,31.97 40.76,34.63 27.69,36.59 24.38,37.57 21.95,40.81 | NUCLEO-HEADER.52 21.89,69.5 21.95,67.13 21.5,64.1 21.73,51.4 | 21.95,40.81 JP3.3 | 21.95,40.81 21.87,43.72 | 21.87,43.72 21.87,43.75 | 21.87,43.72 21.73,51.4 | v38.27,45.42 IC2B.2 | 21.73,51.4 21.75,51.4 v22.12,51.41
CAN-EXT-5V
  Bottom 0.203: 10.36,41.29 D6.A
  Bottom 0.406: JP3.4 17.16,38.85 12.01,39.07 10.36,41.29
CANH2
  Bottom 0.203: IC2B.7 38.3,53.9 38.96,55.88 JP8.3
CANL2
  Bottom 0.203: IC2B.6 36.94,53.98 36.45,55.9 JP8.2
E5V->NUCLEO
  Top 0.406: 14.88,47.81 JP2.1 | 14.88,47.81 JP1.1 10.39,43.8 D6.C 10.38,43.77 8.56,42.86 8.52,41.09 10.35,35.55 10.35,33.63 10.34,32.95 12.89,20.47 12.87,17.37 | D7.C 15,43.83 14.88,47.81
  Top 0.61: NUCLEO-HEADER.6 12.87,17.37
FET-DIODE
  Top 0.203: JP9.3 89.58,14.43 90.49,16.62 D12.C
FET-DRAIN
  Top 0.203: Q1.3 87.47,8.72 91.96,9.82 92.11,12.39 JP9.2 92.95,16.55 D12.A
FROM-U5V
  Top 0.406: JP2.3 JP1.3 5.26,56.76 5.36,72.6 7.59,73.66 13.9,73.76 15.62,70.53 NUCLEO-HEADER.48
GND  (via drill 0.6, 1)
  Top 0.203: U1.18 54.67,40.02 v53.83,39.27 | U1.60 53.13,30.73 v53.82,31.4 53.98,31.3 54.7,30.93 U1.63 54.69,28.62 58.5,27.08 | v39.91,38.11 REG1A.1 | v39.91,38.11 40.01,38.09 C1.2 | v39.91,38.11 40.02,38.06 C2.2 | RESET.3 84.86,13.92 RESET.4 | v55.51,37.02 56.15,37.21 U1.12
  Bottom 0.203: 52.75,39.73 v53.83,39.27 | v53.82,31.4 52.44,31.13 | v39.91,38.11 39.89,38.03 | v55.51,37.02 54.8,35.69 54.1,35.66 C105.2
  other vias: 84.42,46.38 84.38,45.13 82.92,46.39 82.91,45.14 48.08,3.21 59.98,20.76 61.87,39.85 66.34,44.34 43.57,12.82 56.3,4.64 51.7,3.19 43.04,3.22 37.71,3.24 34.58,5.03 29.32,4.71 23.13,4.79 19.32,4.86 14.22,4.86 9.08,4.89 5.84,8.53 6.27,74.84 2.89,64.92 17.24,74.61 17.8,65.28 20.31,59.82 30.37,65.1 12.76,65.08 60.9,74.53 32.17,72.39 29.5,72.35 42.64,47.44 41.88,63.5 54.54,63.39 60.49,68.13 22.92,59.74 23.17,72.83 25.73,72.74 23.16,43.54 27.38,56.07 26.96,59.79 43.88,59.79 27.62,51.01 18.33,45.09 19.25,56.62 23,53.74 48.04,53.54 44.32,50.71 33,48.71 47.9,58.25 4.3,39.64 5.86,24.36 3.86,13.42 14.97,26.6 24.85,25.18 25.22,28.57 25.55,31.44 82.72,2.99 90.77,3.34 85.38,9.86 81.7,20.4 95.42,20.23 59.19,10.13 52.16,12.57 60.31,12.34 94.01,53.74 79.68,59.26 67.55,59.65 67.75,50.32
  pour Bottom (rank 3): -0.26,87.89 -0.56,-1.07 31.76,-2.4 31.98,86.56
  pour Top (rank 4): -0.77,-2.64 33.12,-4.15 34.3,48.3 31.31,50.69 31.3,62.83 53.95,63.34 53.84,77.83 -0.24,77.59
  pour Top (rank 4): 43.46,-2.65 102.5,-2.53 102.73,78.65 43.27,78.72 43.96,53.17 41.22,47.96
  pour Top (rank 4): 27.67,79.74 27.85,57.83 54.55,57.89 54.54,79.71
  pour Top (rank 4): 24.13,-3.05 23.44,53.46 54.49,53.51 54.61,-2.74
  pour Bottom (rank 4): 30.9,80.09 30.55,58.6 43.42,58.64 43.55,52.41 40.58,47.87 34.6,47.97 29.79,53.77 30.57,-1.12 30.24,-4.5 101.94,-3.72 101.49,79.89
GNDA
  Bottom 0.203: IC2B.5 35.73,53.6 34.14,53.85 33.89,55.9 JP8.1
GRN-RED-POLARITY-100K
  Top 0.203: R8.1 98.07,40.13 97.76,41.41 LED3.C 95.82,41.35 LED4.A
LED-EXT-GRN-CATHODE
  Top 0.203: LED1.C 38.26,16.08 R6.1
LED-EXT-RED-CATHODE
  Top 0.203: LED2.C 38.43,14.59 R7.1
PA0  (via drill 0.6)
  Top 0.203: U1.14 58.48,38.18 68.93,32.41 | 68.93,32.41 72.67,30.26 v77.27,30.28 | 68.93,32.41 68.38,32.71 v68.28,32.78 | v61.84,19.28 v66.19,20.5 | D11.2 39.61,6.52 39.64,7.88 40.89,9.74 NUCLEO-HEADER.28
  Bottom 0.203: R110.1 82.76,30.25 R111.1 81.12,30.21 80.97,31.28 78.52,31.24 v77.27,30.28 | v66.19,20.5 68.61,22.08 v68.28,32.78 | 61.76,19.32 59.57,19.02 55.9,18.62 54.17,18.05 50.82,17.18 42.37,14.25 NUCLEO-HEADER.28 40.93,9.72 | 61.76,19.32 61.3,19.17 | 61.76,19.32 61.11,19.2 v61.84,19.28 61.82,19.3 62.19,17.36 C12.1
PA1  (via drill 0.6)
  Top 0.203: U1.15 58.6,38.67 71.67,32.53 | 71.67,32.53 74.01,31.43 74.38,31.46 79.61,31.46 86.25,31.47 93.4,31.47 v94.2,31.35 | v45.31,13.4 49.3,16.5 53.03,16.39 v68.52,16.83 | 71.67,32.53 71.66,32.5 v71.3,32.64 | D11.1 42.14,6.52 42.14,8.31 NUCLEO-HEADER.30
  Bottom 0.203: v45.31,13.4 NUCLEO-HEADER.30 43.48,9.72 | v71.3,32.64 71.67,19.5 v68.52,16.83 68.57,16.8 67.36,13.11 C11.1 | v94.2,31.35 93.53,30.23 R112.1 93.46,30.23 R109.1
PA2  (via drill 0.6)
  Top 0.203: U1.16 58.78,39.25 73.98,32.72 74.42,32.73 | 74.42,32.73 v77.26,32.78 | NUCLEO-HEADER.75 51.26,66.83 54.72,65.28 v73.83,65.61 | 74.42,32.73 v73.94,32.7
  Bottom 0.203: R114.1 81.05,32.81 R117.1 80.76,33.89 78.25,33.9 v77.26,32.78 | v73.94,32.7 v73.83,65.61 73.8,66.06 72.37,66.87 72.13,67.92 71.97,70.71 C17.1 | D100.1 51.33,65.64 NUCLEO-HEADER.75
PA3  (via drill 0.6)
  Top 0.203: 75.24,34.01 74.36,34.01 74.09,33.99 72.95,34.45 56.05,41.17 U1.17 | 75.24,34.01 79.64,34.01 93.33,34.03 93.35,34.03 v94.24,33.91 | NUCLEO-HEADER.77 55.51,66.32 v75.28,67.34 | 75.24,34.01 75.24,34.02 v75.33,34
  Bottom 0.203: v94.24,33.91 R115.1 93.75,32.74 R116.1 | v75.33,34 74.94,35.65 75.01,63.47 v75.28,67.34 73.67,67.64 73.82,70.16 75.13,71.23 75.79,71.88 C18.1 | 53.6,67.94 NUCLEO-HEADER.77 53.7,67.91 53.66,65.4 D100.2
PA4  (via drill 0.6)
  Top 0.203: U1.20 53.69,42.73 57.62,42.69 72.67,36.03 | 72.67,36.03 74.48,35.42 v77.34,35.39 | v47.66,13.45 49.94,15.42 v70.57,15.56 | 72.67,36.03 72.5,36.13 v72.36,36.14 | D10.2 44.66,6.52 44.71,8.44 46.03,9.8 NUCLEO-HEADER.32
  Bottom 0.203: R118.1 80.94,35.35 R119.1 81.01,35.34 80.87,36.31 78.21,36.34 v77.34,35.39 | v47.66,13.45 NUCLEO-HEADER.32 45.97,9.73 | v72.36,36.14 72.61,35.04 73.04,18.51 v70.57,15.56 70.48,15.52 70.77,11.53 C10.1
PA5  (via drill 0.6)
  Top 0.203: 74.47,36.57 74.43,36.57 | 74.47,36.57 79.57,36.56 93.25,36.57 93.28,36.56 v94.28,36.45 | U1.21 53.21,43.2 57.82,43.17 71.36,37.93 | 74.47,36.57 74.47,36.53 72.75,37.4 71.36,37.93 | NUCLEO-HEADER.51 21.92,69.37 21.89,74.52 56.95,74.54 59.61,72.65 | 59.61,72.65 62.95,70.17 67.07,70.17 68.11,70.13 68.67,70.08 v68.99,70.52 | 71.36,37.93 71.38,37.97 v71.32,38.03 | NUCLEO-HEADER.51 20.61,68.02 | NUCLEO-HEADER.51 20.33,65.14 18.6,64.07 18.58,63.26 D3.1 | v62.57,72.05 60.26,72.59 59.6,72.63 59.61,72.65
  Bottom 0.203: v94.28,36.45 R121.1 93.68,35.31 R120.1 | v68.99,70.52 70.28,64.14 70.41,47.3 v71.32,38.03 | v62.57,72.05 C5.1
PA6  (via drill 0.6)
  Top 0.203: U1.22 52.7,43.63 57.99,43.6 72.88,38.73 74.62,37.88 v77.36,37.88 | v78.72,67.87 76.85,70.58 74.68,70.67 73.45,69.9 72.96,69.23 62.61,69.22 59.33,72.16 56.84,73.91 24.47,74 24.47,69.33 NUCLEO-HEADER.53 23.16,67.97 23.01,63.53 D1.2
  Bottom 0.203: R124.1 81.03,37.83 R125.1 80.96,37.86 80.69,39.04 77.96,39.01 v77.36,37.88 77.29,37.89 76.85,38.96 76.86,64.2 v78.72,67.87 79.2,68.38 81.84,70.82 C14.1
PA7  (via drill 0.6)
  Top 0.203: 74.36,39.12 74.33,39.12 | 76.12,39.12 74.36,39.12 | 76.12,39.12 79.59,39.11 93.23,39.12 93.23,39.11 v94.25,38.98 | U1.23 52.15,44.07 58.2,44.08 72.86,39.78 74.36,39.12 | 74.36,39.12 | v75.81,69.02 73.44,68.63 62.23,68.63 58.9,71.8 56.67,73.34 26.99,73.37 27.02,69.4 NUCLEO-HEADER.55 25.73,68.04 24.93,66.04 25,63.66 D1.1 | 76.12,39.12 76.12,39.13 v75.95,39.07
  Bottom 0.203: v94.25,38.98 R123.1 93.65,37.84 R122.1 | v75.95,39.07 75.86,63.87 76.54,66.38 76.91,67.89 76.62,68.52 v75.81,69.02 75.69,69.29 78.93,70.86 C13.1
PA9-USART1-TX  (via drill 0.6)
  Top 0.203: U1.42 44.35,34.71 43.35,34.78 42.35,34.31 v41.06,32.59 | v32.19,28.67 32.92,30.21 | 32.92,30.21 32.95,30.27 38.64,30.47 JP5.5 | 32.92,30.21 32.99,30.18 v32.35,37.81
  Bottom 0.203: JP5.5 38.41,30.53 | 38.41,30.53 40.6,31.69 v41.06,32.59 | 38.41,30.53 38.17,30.37 | USB-SERIAL.14 17.73,31.38 v32.19,28.67 | NUCLEO-HEADER.61 31.65,63.01 v32.35,37.81
PA10-USART1-RX  (via drill 0.6)
  Top 0.203: U1.43 44.22,34.2 43.43,34.27 42.72,33.83 42.13,32.3 41.59,30.92 v41.21,29.54 | v46.11,62.48 40.54,60.09 34.6,60.07 v29.16,61.09 | v29.27,38.46 27.56,35.9 26.86,34.34 USB-SERIAL.10
  Bottom 0.203: 38.42,27.97 JP5.4 | 38.42,27.97 v41.21,29.54 | 38.42,27.97 32.55,30.24 27.23,31.82 26.93,34.28 USB-SERIAL.10 | NUCLEO-HEADER.73 48.68,65.05 v46.11,62.48 | v29.27,38.46 v29.16,61.09
PA13-SWDIO
  Top 0.203: U1.46 45.03,32.72 44.53,32.15 43.88,31.25 42.55,30.29 42.32,27.88 42.88,26.87 43.92,25.79 JP6.3
PA14-SWCLK
  Top 0.203: U1.49 47.68,28.85 47.4,27.4 47.13,26.53 46.11,24.97 45.07,23.19 JP6.2
PB0  (via drill 0.6)
  Top 0.203: R2.1 R129.1 v52.43,54.35 52.4,54.35 51.12,47.43 | U1.26 50.7,45.23 51.12,47.43 | v57.42,17.55 60.19,18.04 v66.8,18.09 | 51.12,47.43 51.26,47.4 v60.26,46.33 | D10.1 47.27,6.51 47.25,8.33 48.49,9.72 NUCLEO-HEADER.34
  Bottom 0.203: v52.43,54.35 R129.1 | v57.42,17.55 50.81,15.69 49.86,14.67 NUCLEO-HEADER.34 48.52,9.73 | v60.26,46.33 69.76,33.38 69.79,20.68 v66.8,18.09 66.85,18.02 65.92,15.94 C9.1
PB0-680K-RY2  (via drill 0.6)
  Top 0.203: v63.44,55.17 57.8,55.15 55.3,54.31 R2.2
  Bottom 0.203: RY2.4 67.3,54.83 v63.44,55.17
PB1  (via drill 0.6)
  Top 0.203: R1.1 v52.32,56.85 52.34,56.83 51.53,54.65 50.19,45.43 U1.27 | NUCLEO-HEADER.64 35.86,70.61 34.68,69.28 34.66,67.32 34.7,66.48 34.79,65.43 34.89,64.77 v35.01,64.24 37.11,64.18 D2.2
  Bottom 0.203: v52.32,56.85 R131.1 | v52.32,56.85 52.35,56.75 51.26,59.59 51.28,59.59 49.22,60.09 v35.01,64.24 | C16.1 50.33,57.44 51.69,57.58 52.27,57.01 v52.32,56.85
PB1-680K-RY1  (via drill 0.6)
  Top 0.203: v64.86,56.5 58.06,56.13 55.32,56.83 R1.2
  Bottom 0.203: v64.86,56.5 67.03,56.08 RY1.9
PB2  (via drill 0.6)
  Top 0.203: U1.28 49.69,45.43 51.37,57.25 56.65,63.42 | 56.65,63.42 59.52,63.97 63.26,63.95 v64.04,63.44 | NUCLEO-HEADER.62 35.09,72.77 56.41,72.77 58.49,71.46 58.49,67.78 v58.67,67.82 | 56.65,63.42 56.69,63.34 v56.16,63.02
  Bottom 0.203: Q101.1 64.29,62.26 v64.04,63.44 | v56.16,63.02 v58.67,67.82
PB6  (via drill 0.6)
  Top 0.203: 54.73,21.03 JP7.3 54.7,21.03 | v54.27,25.41 52.89,25.6 R5.2 52.93,25.42 52.97,26.39 52.2,28.34 U1.58 | v30.65,27.59 v30.68,39.49
  Bottom 0.203: v54.27,25.41 54.65,25.24 JP7.3 54.77,21.14 53.94,19.05 44.48,17.4 32.49,18.23 v30.65,27.59 | NUCLEO-HEADER.57 27.69,65.15 30.46,62.29 v30.68,39.49
PB7
  Top 0.203: JP7.4 57.21,21.11 | JP7.4 57.26,21.02 57.23,22.39 56.15,23.11 53.63,24.62 | 53.63,24.62 52.07,24.62 51.31,25.47 R4.2 | U1.59 52.7,29.65 52.69,28.44 55.38,26.59 55.34,24.71 54.74,23.95 | 54.74,23.95 | 54.74,23.95 54.78,23.95 53.63,24.62 | NUCLEO-HEADER.21 34.52,8.45 38.95,8.45 39.61,9.15 39.62,10.77 40.35,11.47 41.79,12.49 45.46,15.37 48.68,17.46 52.75,18.72 56.4,18.87 57.37,21.21 JP7.4
PB9  (via drill 0.6)
  Top 0.203: U1.62 54.2,28.51 57.98,25.09 59.5,22.58 66.97,22.43 85.57,6 86.59,5.93 Q1.1 86.52,4.15 R9.2 86.4,4.1 v84.83,4.08
  Bottom 0.203: NUCLEO-HEADER.45 11.15,65.72 0.96,61.31 0.96,7.27 4.72,5.55 8.01,0.74 83.75,0.79 v84.83,4.08
PB10  (via drill 0.6)
  Top 0.203: U1.29 49.19,45.7 v49.32,49.44 49.31,58.2 48.04,63.56 48.04,63.55 v43.71,64.1 | v53.1,51.78 57.8,54.23 60.48,52.41 62.91,52.54 v64.24,53.86
  Bottom 0.203: v49.32,49.44 v53.1,51.78 | Q100.1 64.82,52.59 v64.24,53.86 | v43.71,64.1 39.88,65.82 38.38,68 NUCLEO-HEADER.65
PB11-I2C2-SDA|VCAP1  (via drill 0.6)
  Top 0.203: v47.41,42.84 48.69,41.96 U1.30
  Bottom 0.203: 47.66,42.07 CP103.1
  Bottom 0.61: v47.41,42.84 47.66,42.07
PC0  (via drill 0.6)
  Top 0.203: v77.38,23.53 71.35,25.21 62.19,32.45 58.5,35.19 58.51,35.2 U1.8 | v77.34,9.85 61.3,9 59.36,8.65 57.41,8.49 54.88,8.59 53.61,9.76 NUCLEO-HEADER.38 53.55,9.78 53.26,9.03 52.31,7.83 52.37,6.52 D8.2
  Bottom 0.203: 81.14,25.12 81.07,26.34 78.46,26.32 v77.38,23.53 77.4,23.56 77.51,15.68 v77.34,9.85 77.28,9.88 C7.1 | 81.14,25.12 82.69,25.16 | 82.69,25.16 82.72,25.16 | NUCLEO-HEADER.38 53.61,9.68 | 81.14,25.12 81.14,25.13 R101.1 | R100.1 82.68,25.51 82.69,25.16
PC1  (via drill 0.6)
  Top 0.203: 74.83,26.41 74.67,26.41 | 74.83,26.41 79.67,26.4 86.25,26.4 93.38,26.46 94.15,26.33 94.16,26.33 v94.33,26.38 | U1.9 58.75,35.71 72.41,26.41 73.85,26.4 | 74.83,26.41 74.83,26.4 73.85,26.4 | v50.8,13.33 52.12,14.54 v72.19,14.41 | 73.85,26.4 73.85,26.39 v73.84,26.34 | D9.2 49.79,6.55 49.81,8.26 51.05,9.73 NUCLEO-HEADER.36
  Bottom 0.203: v50.8,13.33 NUCLEO-HEADER.36 51.06,9.74 | v73.84,26.34 74.07,17.99 v72.19,14.41 72.21,14.48 72.46,11.32 72.46,8.08 C3.1 | R102.1 | R102.1 R103.1 | v94.33,26.38 R102.1
PC2  (via drill 0.6)
  Top 0.203: U1.10 59.01,36.18 72.4,27.68 75,27.63 | 75,27.63 v77.23,27.64 | v53.96,12.37 54.65,13.45 v73.77,12.88 | 75,27.63 75,27.62 v74.94,27.62 | D9.1 51.08,6.07 51.09,7.17 NUCLEO-HEADER.35
  Bottom 0.203: R107.1 82.77,27.7 R108.1 81.08,27.63 80.78,28.91 78.05,28.9 v77.23,27.64 | v53.96,12.37 52.2,11 52.29,8.5 NUCLEO-HEADER.35 51.03,7.17 | v74.94,27.62 75.02,27.62 75.16,17.47 v73.77,12.88 73.69,12.81 73.83,7.77 C4.1
PC3  (via drill 0.6)
  Top 0.203: 75.96,28.95 74.47,28.95 72.38,28.95 59.34,36.71 U1.11 | 75.96,28.95 79.66,28.96 86.24,28.96 90.2,28.94 93.32,28.96 v94.21,28.79 | v56.66,12 60.1,11.43 v75.5,11.28 | v75.96,28.94 75.96,28.95 | D8.1 54.29,6.14 53.55,7.21 NUCLEO-HEADER.37
  Bottom 0.203: v56.66,12 54.89,11.22 54.82,8.39 NUCLEO-HEADER.37 53.51,7.19 | v75.96,28.94 76.15,16.11 v75.5,11.28 75.49,11.31 75.53,9.12 77.78,7.58 C8.1 | v94.21,28.79 93.46,27.63 R106.1 93.64,27.6 R105.1
PC4  (via drill 0.6)
  Top 0.203: U1.24 51.71,44.5 58.64,44.51 72.79,40.81 | 72.79,40.81 72.84,40.8 | 72.79,40.81 72.79,40.8 72.63,40.84 | 72.63,40.84 v78.05,40.38 | NUCLEO-HEADER.74 49.91,69.09 49.86,66.66 49.96,66.62 | 49.96,66.62 51.63,65.93 54.56,64.72 68.97,65.03 v72.91,64.33 | 72.63,40.84 v72.65,41.21 v72.64,41.22 | D2.1 39.82,64.28 42.16,65.84 49.35,66.04 49.93,66.55 49.96,66.62
  Bottom 0.203: R126.1 80.94,40.4 R127.1 80.9,41.66 78.13,41.71 v78.05,40.38 | v72.64,41.22 72.71,41.02 v72.91,64.33 72.94,64.3 71.39,65.88 70.62,70.77 69.79,71.45 C15.1
PC5  (via drill 0.6)
  Top 0.203: 52.51,44.99 51.19,45 U1.25 | 52.51,44.99 58.64,44.99 60.86,45.01 65.11,46.19 66.16,46.16 v66.05,46.15 67.04,46.18 R3.1 | NUCLEO-HEADER.46 14.35,69.1 14.28,66.39 14.52,65.35 | 14.54,64.83 14.85,58.59 v45.81,58.43 | 14.54,64.83 14.52,65.35 | 52.51,44.99 52.49,45.14 v52.44,45.59 | 14.52,65.35 14.46,65.34 | D3.2 16.54,64.44 14.61,64.83 14.54,64.83
  Bottom 0.203: R128.1 v66.05,46.15 66.07,46.14 | v45.81,58.43 45.76,47.05 46.65,45.26 v52.44,45.59 v52.44,45.58 55.39,45.52 C6.1
PC5-680K-RY2
  Top 0.203: RY2.9 68.82,47.31 68.87,46.09 R3.2
PC10  (via drill 0.6)
  Top 0.203: v48.52,23.38 47.65,21.58 47.37,18.14 R7.2 41.2,14.35 41.18,13.46 39.06,12.23 17.66,12.18 v14.67,12.19 | v51.21,26.77 51.21,29.07 51.2,29.71 U1.56
  Bottom 0.203: v48.52,23.38 v51.21,26.77 | v14.67,12.19 9.78,11.33 9.12,10.37 9.15,8.83 7.76,7.15 NUCLEO-HEADER.1
PC11  (via drill 0.6)
  Top 0.203: v48.27,25.07 46.88,21.83 46.57,18.45 43.43,16.5 R6.2 41.24,16.45 41.21,15.73 40.3,15.07 40.3,13.65 39.14,12.77 18.01,12.73 v15.69,13.72 | v49.98,27.11 50.67,28.99 50.69,29.7 U1.55
  Bottom 0.203: v48.27,25.07 v49.98,27.11 | v15.69,13.72 9.2,12.21 7.94,9.76 NUCLEO-HEADER.2
PD0_OSC_IN_XTAL
  Top 0.203: U1.5 57.89,33.72 59.74,30.09 59.84,25.53 XTAL1.2
  Bottom 0.203: R104.1 59.8,25.07 XTAL1.2 59.74,25.11 59.22,24.33 59.22,23.65 C101.1
PD1_OSC_OUT
  Top 0.203: U1.6 58.05,34.24 64.33,26.44 64.49,25.07 XTAL1.1
  Bottom 0.203: R104.2 64.46,25.24 XTAL1.1 65.93,24.52 65.95,23.42 C100.1
PGND-SRN  (via drill 0.6)
  Top 0.203: 86.84,47.98 JP4.1 v81.9,48.04 | RY2.5 71.28,53.49 v81.87,53.01
  Top 1.016: JP4.1 86.87,48.02
  Bottom 0.203: v81.9,48.04 v81.87,53.01 81.81,52.92 83.85,57.25 R132.1
Q12-DRAIN-RELAY
  Bottom 0.203: D4.A 61.2,57.92 RY1.- 62.13,61.28 Q101.3
Q12-DRAIN-RELAY1
  Bottom 0.203: D5.A 61.31,48.47 RY2.- 62.66,51.65 Q100.3
RESET  (via drill 0.6)
  Top 0.203: RESET.2 83.18,17.48 83.13,17.48 | 83.13,17.48 RESET.1 70.34,24.34 61.93,31.41 v61.95,31.38 61.35,32.26 58.25,34.71 U1.7 | 83.13,17.48 83.13,17.55 v82.97,16.4
  Bottom 0.203: v61.95,31.38 R113.1 | NUCLEO-HEADER.14 24.37,8.46 24.37,5.59 26.32,1.34 80.54,1.31 82.94,10.56 v82.97,16.4
SRP  (via drill 0.6)
  Top 0.203: RY1.8 74.6,56.61 81.41,56.64 | 81.41,56.64 89.18,49.54 89.42,47.9 JP4.2 | 81.41,56.64 81.41,56.57 v83.41,59.17
  Bottom 0.203: v83.41,59.17 R133.1
USB-SERIAL-5V
  Top 0.406: 17.97,35.73 17.99,33.6 17.99,32.65 | 19.48,23.01 19.37,22.99 | 18.75,27.69 18.81,27.7 JP5.3
  Top 0.61: USB-SERIAL.4 19.49,22.91 19.48,23.01 18.75,27.69 17.99,32.65 | 17.97,35.73 D7.A
VCC  (via drill 0.6, 1)
  Top 0.203: U1.64 55.18,31.08 v55.61,31.25 | U1.19 54.2,42.23 55.45,42.22 v57.17,41.85 | v52.08,33.91 v51.7,36.88 | v49.73,36.82 49.74,35.38 v49.73,33.91 | LED1.A 36.77,16.1 LED2.A | LED1.A 36.73,16.05 | JP7.2 52.17,21.03 | JP7.2 52.14,21 R4.1 | R4.1 R5.1 | 54.18,40.66 54.18,42.2 | REG1A.3 39.89,42.3 v41.73,42.41 | R4.1 50.51,23.77 49.49,23.83 48.98,27.92 v48.59,27.64 48.67,27.84 47.72,26.06 46.89,24.75 46.27,21.85 45.84,18.83 43.3,17.38 37.27,17.34 36.76,16.18 LED1.A | v46.3,27.53 46.28,28.04 | JP7.2 52.02,20.95 | v57.67,30.39 57.7,30.41
  Bottom 0.203: 55.43,32.11 C104.1 | 57.14,41.67 v57.17,41.85 | 41.68,42.43 v41.73,42.41 41.8,42.39 39.55,45.91 IC2B.1 | v48.59,27.64 v46.3,27.53 | v57.67,30.39 R113.2
  Bottom 0.406: 52.08,33.41 v52.08,33.91 | 49.78,33.56 v49.73,33.91 | v57.17,41.85 57.17,41.82
  Bottom 0.61: v55.61,31.25 55.43,32.11 | BEAD.1 57.14,41.67 | v51.7,36.88 C106.1 | C103.1 52.08,33.41 | v49.73,36.82 CP102.1 | C102.1 49.78,33.56 | v41.73,42.41 C108.1 | 41.68,42.43 42.3,41.96 C107.1 | C109.1 56.88,42.87 57.17,41.82
  pour Top: 38.5,43.17 38.6,37.91 42.25,27.56 60.86,27.67 60.72,43.14
VDDA1  (via drill 0.6)
  Top 0.203: U1.13 56.16,37.71 v55.34,38.66
  Bottom 0.203: C105.1 55.15,38.66 v55.34,38.66
  Bottom 0.406: C105.1 55.14,38.54 BEAD.2
VSS_1-VCAP_1  (via drill 0.6)
  Top 0.203: U1.31 48.19,39.97 v47.91,39.16
  Bottom 0.203: 47.62,38.52 v47.91,39.16
  Bottom 0.406: CP101.1 47.62,38.52
VSS_3  (via drill 0.6)
  Top 0.203: U1.47 46.94,32.21 v47.48,32.39
  Bottom 0.406: v47.48,32.39 47.49,32.78
  Bottom 0.61: 47.49,32.78 CP100.1

### Text on the board
Top: bmscableNucleo | V1 | 210226
tNames: 2 | 40 | 1 | 39 | SRP | 5v select | PB | SRN | G | CAN1 | 4 | Polarity | 2 | RESET | GND | 6 | 8 | 16 | 10 | 8 | 16 | 14 | 3 | 3 | 7 | 1 | 7 | 5 | 11 | 11 | FTDI | 9 | 15 | 15 | SWD | 13 | GND | GND | I2C1 | 2 | 40 | 1 | 39
bNames: ISOCAN | 1 | SRP | G | C0 | C4 | C8 | 12 | 16 | 3 | 7 | 11 | 15 | 20
tValues: 3.3V | DIGITAL | +5V | 3.2v | ANALOG | 3.2 | G